# EAGLE design board (EAGLE 6.4)
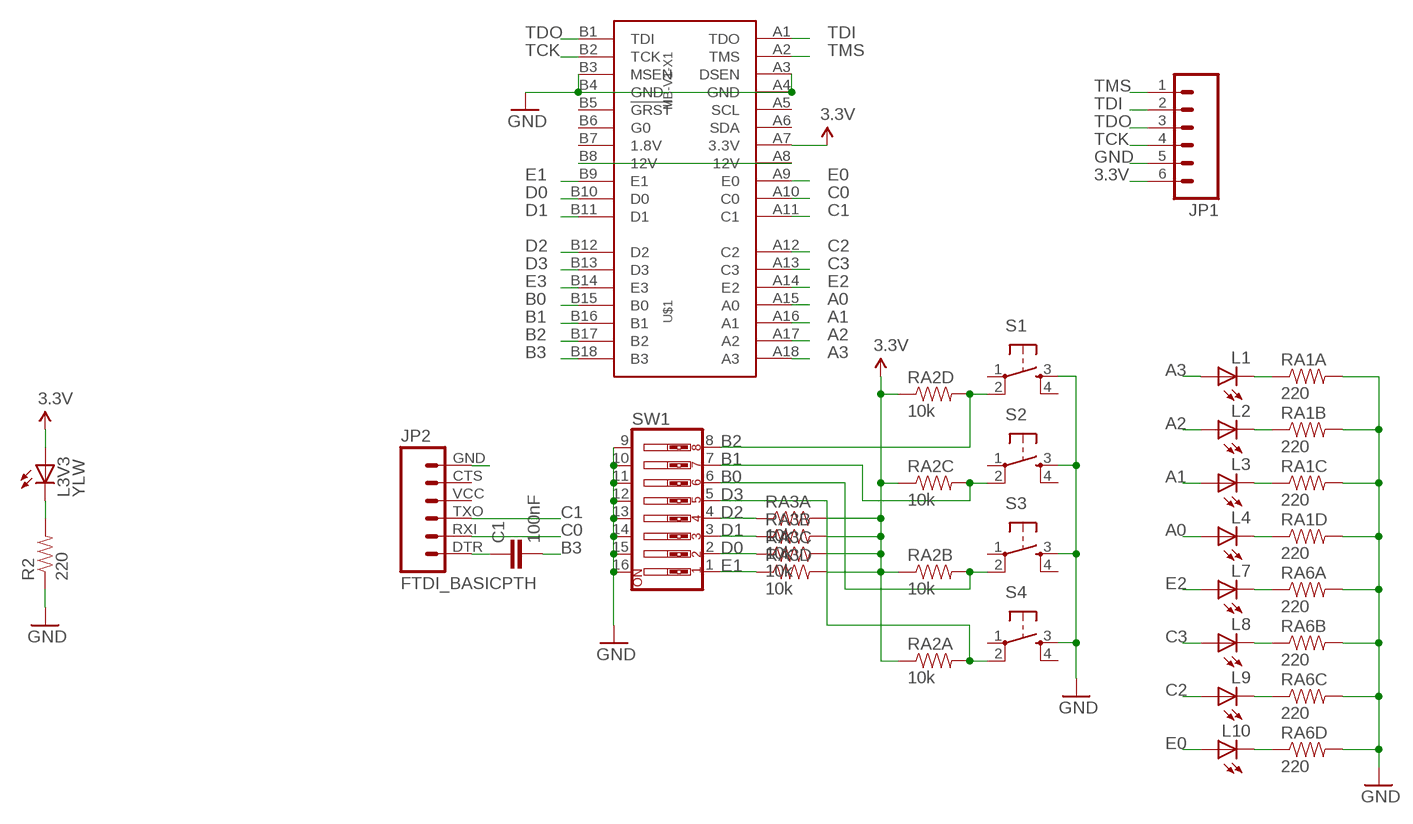
[diagram p0: schematic, sheet 1]

## Parts
C1  100nF  CAP0402-CAP  [0402-CAP]
JP1  M06LOCK  [1X06_LOCK]
JP2  FTDI_BASICPTH  [FTDI_BASIC]
L1  LED0603  [0603_LED]
L2  LED0603  [0603_LED]
L3  LED0603  [0603_LED]
L3V3  YLW  LED0603  [0603_LED]
L4  LED0603  [0603_LED]
L7  LED0603  [0603_LED]
L8  LED0603  [0603_LED]
L9  LED0603  [0603_LED]
L10  LED0603  [0603_LED]
R2  220  RESISTOR0603  [0603-RES]
RA1  220  RESISTOR_ARRAY0603_X4  [0603-ARV]
RA2  10k  RESISTOR_ARRAY0603_X4  [0603-ARV]
RA3  10k  RESISTOR_ARRAY0603_X4  [0603-ARV]
RA6  220  RESISTOR_ARRAY0603_X4  [0603-ARV]
S1  TAC_SWITCHPTH  [TACTILE-PTH]
S2  TAC_SWITCHPTH  [TACTILE-PTH]
S3  TAC_SWITCHPTH  [TACTILE-PTH]
S4  TAC_SWITCHPTH  [TACTILE-PTH]
SW1  SW_DIP-8  [DIPSWITCH-08]
U$1  MB-V1-X1  [PCIE-X1-EDGE]

## Nets
3.3V: JP1.6 L3V3.A RA2.1 RA2.2 RA2.3 RA2.4 RA3.5 RA3.6 RA3.7 RA3.8 U$1.A7(3.3V)
A0: L4.A U$1.A15(A0)
A1: L3.A U$1.A16(A1)
A2: L2.A U$1.A17(A2)
A3: L1.A U$1.A18(A3)
B0: RA2.7 S3.2 SW1.6 U$1.B15(B0)
B1: RA2.6 S2.2 SW1.7 U$1.B16(B1)
B2: RA2.5 S1.2 SW1.8 U$1.B17(B2)
B3: C1.2 U$1.B18(B3)
C0: JP2.RXI U$1.A10(C0)
C1: JP2.TXO U$1.A11(C1)
C2: L9.A U$1.A12(C2)
C3: L8.A U$1.A13(C3)
D0: RA3.3 SW1.2 U$1.B10(D0)
D1: RA3.2 SW1.3 U$1.B11(D1)
D2: RA3.1 SW1.4 U$1.B12(D2)
D3: RA2.8 S4.2 SW1.5 U$1.B13(D3)
E0: L10.A U$1.A9(E0)
E1: RA3.4 SW1.1 U$1.B9(E1)
E2: L7.A U$1.A14(E2)
E3: U$1.B14(E3)
GND: JP1.5 JP2.GND R2.1 RA1.5 RA1.6 RA1.7 RA1.8 RA6.5 RA6.6 RA6.7 RA6.8 S1.3 S2.3 S3.3 S4.3 SW1.9 SW1.10 SW1.11 SW1.12 SW1.13 SW1.14 SW1.15 SW1.16 U$1.A3(DSEN) U$1.A4(GND) U$1.B3(MSEN) U$1.B4(GND)
N$2: L1.C RA1.1
N$3: L2.C RA1.2
N$4: L3.C RA1.3
N$5: L4.C RA1.4
N$6: L3V3.C R2.2
N$11: C1.1 JP2.DTR
N$14: L7.C RA6.1
N$15: L8.C RA6.2
N$16: L9.C RA6.3
N$17: L10.C RA6.4
N$22: U$1.A8(12V) U$1.B8(12V)
TCK: JP1.4 U$1.B2(TCK)
TDI: JP1.2 U$1.A1(TDO)
TDO: JP1.3 U$1.B1(TDI)
TMS: JP1.1 U$1.A2(TMS)
Unconnected: JP2.CTS JP2.VCC S1.1 S1.4 S2.1 S2.4 S3.1 S3.4 S4.1 S4.4 U$1.A5(SCL) U$1.A6(SDA) U$1.B5(!GRST) U$1.B6(G0) U$1.B7(1.8V)

## Library data of the parts
C1 = kmod-passives:CAP: Capacitor Standard 0603 ceramic capacitor, and 0.1" leaded capacitor.
JP1 = SparkFun-Connectors:M06: Header 6 Standard 6-pin 0.1" header. Use with straight break away headers (SKU : PRT-00116), right angle break away headers (PRT-00553), swiss pins (PRT-00743), machine pins (PRT-00117), and female headers (PRT-00115). Molex polarized connector foot print use with SKU : PRT-08094 with associated crimp pins and housings. NOTES ON THE VARIANTS LOCK and LOCK_LONGPADS... This footprint was designed to help hold the alignment of a through-hole component (i.e. 6-pin header) while soldering it into place. You may notice that each hole has been shifted either up or down by 0.005 of an inch from it's more standard position (which is a perfectly straight line). This slight alteration caused the pins (the squares in the middle) to touch the edges of the holes. Because they are alternating, it causes a "brace" to hold the component in place. 0.005 has proven to be the perfect amount of "off-center" position when using our standard breakaway headers. Although looks a little odd when you look at the bare footprint, once you have a header in there, the alteration is very hard to notice. Also,if you push a header all the way into place, it is covered up entirely on the bottom side. This idea of altering the position of holes to aid alignment will be further integrated into the Sparkfun Library for other footprints. It can help hold any component with 3 or more connection pins.
JP2 = SparkFun-Connectors:FTDI_BASIC: FTDI Basic header with labels
L1-L3 L3V3 L4 L7-L10 = kmod-passives:LED
R2 = kmod-passives:RESISTOR: Resistor Basic schematic elements and footprints for 0603, 1206, and PTH resistors.
RA1-RA3 RA6 = kmod-passives:RESISTOR_ARRAY
S1-S4 = kmod-mechanical:TAC_SWITCH: Momentary Switch Button commonly used for reset or general input. Spark Fun Electronics SKU : COM-00097 SMT- SWCH-08247
SW1 = SparkFun-Electromechanical:SW_DIP-8: DIP Switch 8 Position Spark Fun Electronics SKU : COM-08034
U$1 = kmod-connectors:MB-V1-X1

## Board
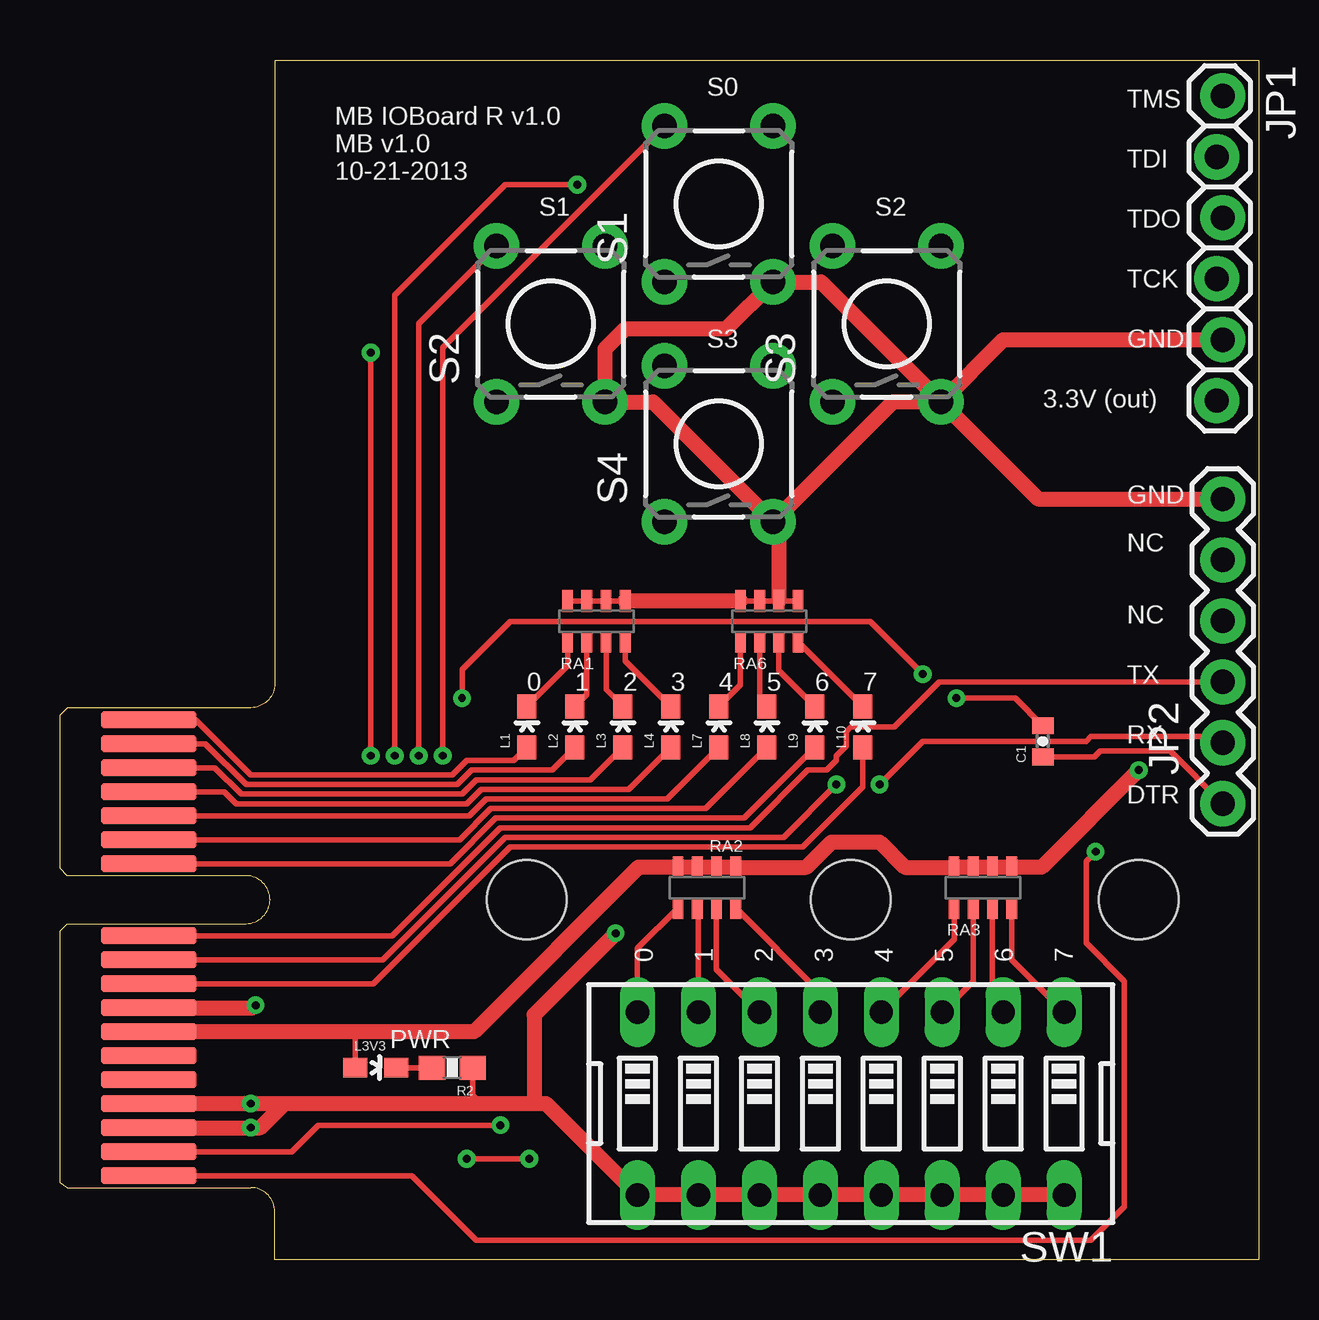
[diagram p1: board, top side]
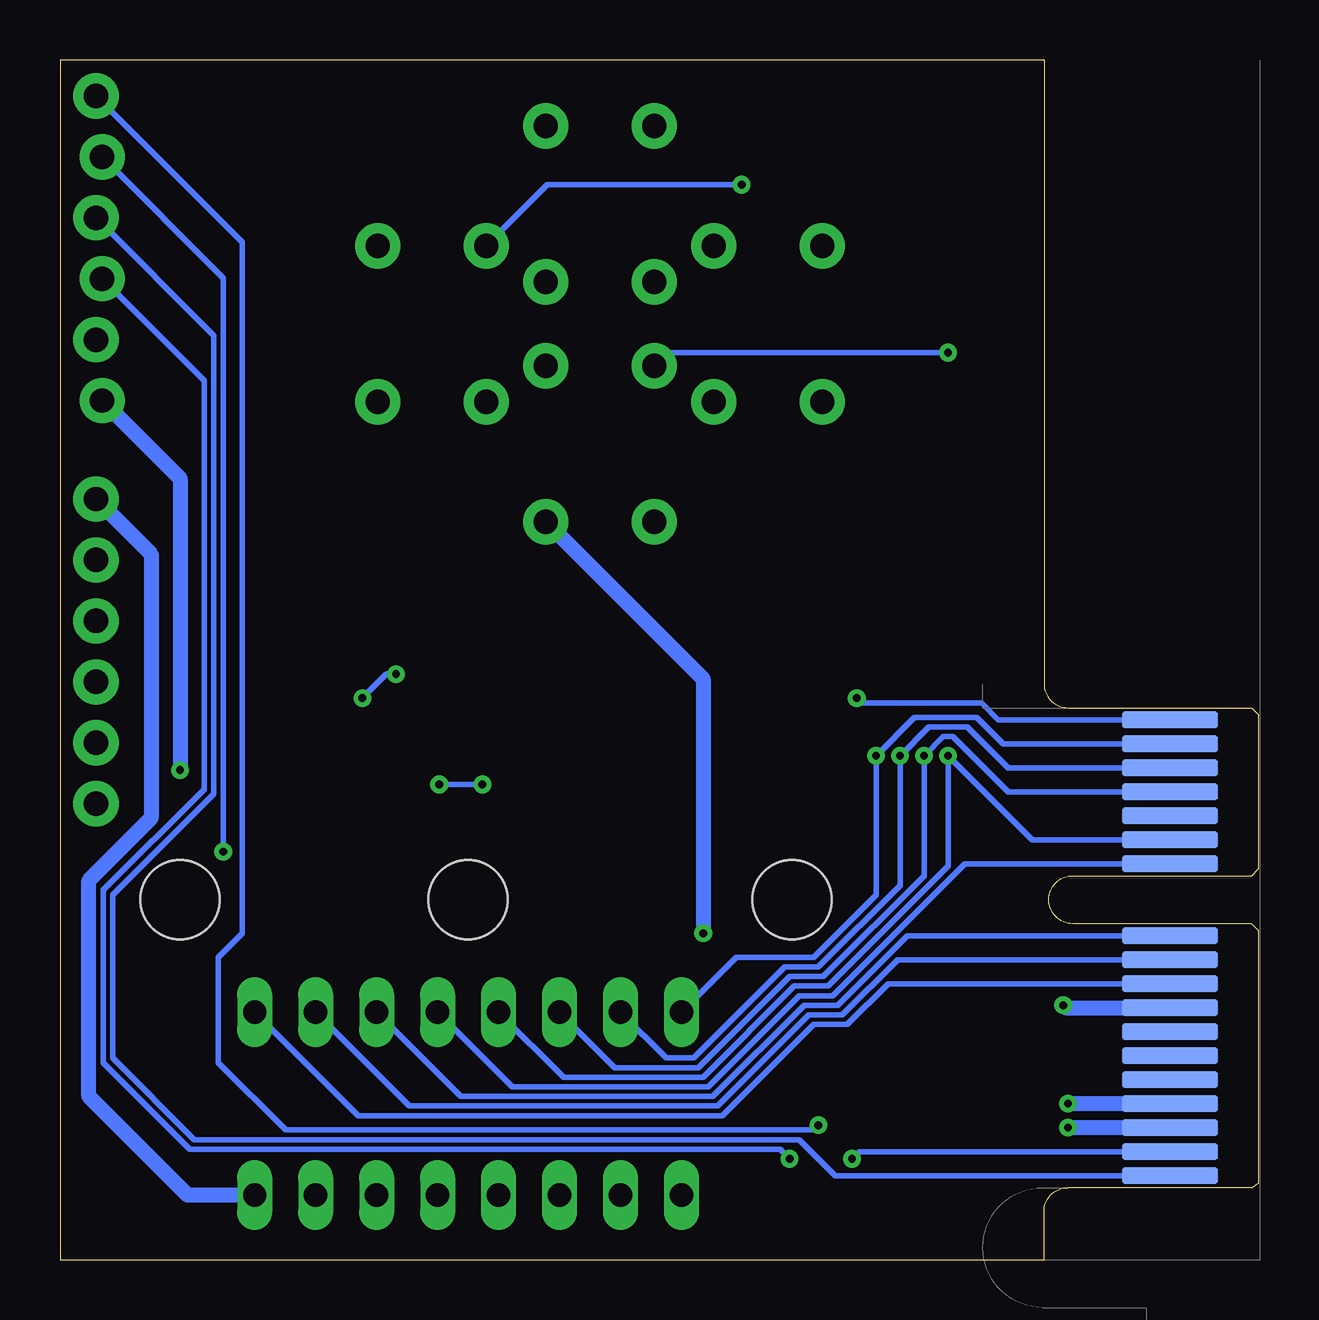
[diagram p2: board, bottom side, seen from below]

Size 49.95 x 50 mm. Coordinates in mm from the lower left corner, seen from the top.
Outline: 7.95,3 arc-90 8.95,2 8.95,0 49.95,0 49.95,50 8.95,50 8.95,24 arc-90 7.95,23
Copper layers (1*16): Top 0.035mm / dielectric 1.5mm / Bottom 0.035mm
Design rules "SeeedStudio_mine": minimum track width 6mil, minimum drill 12mil, track to track 6mil, track to pad 6mil, pad to pad 6mil, via to via 6mil, smd to smd 6mil, copper to edge 10mil, drill to drill 10mil, minimum pad ring 6mil, minimum via ring 8mil, stop-mask expansion 2mil, vias tented up to drill 25mil, thermal gap 10mil
Holes 3.3 mm at 44.95,15 32.95,15 19.45,15

### Footprints (pad centres in the part's own frame; a part is rotated, then mirrored left to right if it is on the bottom)
0402-CAP = smd 0.7 x 0.9: 1 -0.65,0; 2 0.65,0
1X06_LOCK = drill 1.016 pad 1.88: 1 0,0; 2 2.54,-0.254; 3 5.08,0; 4 7.62,-0.254; 5 10.16,0; 6 12.7,-0.254
FTDI_BASIC = drill 1.016 pad 1.88: CTS 10.16,0; DTR 0,0; GND 12.7,0; RXI 2.54,0; TXO 5.08,0; VCC 7.62,0
0603_LED = smd 0.8 x 1.003: A 0,-0.852; C 0,0.852
0603-RES = smd 1.1 x 1: 1 -0.85,0; 2 0.85,0
0603-ARV = smd 0.45 x 0.9: 1 -1.2,-0.85; 2 -0.4,-0.85; 3 0.4,-0.85; 4 1.2,-0.85; 5 1.2,0.85; 6 0.4,0.85; 7 -0.4,0.85; 8 -1.2,0.85
TACTILE-PTH = drill 1.016 pad 1.88: 1 -3.251,2.261; 2 3.251,2.261; 3 -3.251,-2.261; 4 3.251,-2.261
DIPSWITCH-08 = drill 0.97 long: 1 -8.89,-3.81; 2 -6.35,-3.81; 3 -3.81,-3.81; 4 -1.27,-3.81; 5 1.27,-3.81; 6 3.81,-3.81; 7 6.35,-3.81; 8 8.89,-3.81; 9 8.89,3.81; 10 6.35,3.81; 11 3.81,3.81; 12 1.27,3.81; 13 -1.27,3.81; 14 -3.81,3.81; 15 -6.35,3.81; 16 -8.89,3.81
PCIE-X1-EDGE = smd 0.7 x 4 bottom: A1 -11.5,-0.75; A2 -10.5,-0.75; A3 -9.5,-0.75; A4 -8.5,-0.75; A5 -7.5,-0.75; A6 -6.5,-0.75; A7 -5.5,-0.75; A8 -4.5,-0.75; A9 -3.5,-0.75; A10 -2.5,-0.75; A11 -1.5,-0.75; A12 1.5,-0.75; A13 2.5,-0.75; A14 3.5,-0.75; A15 4.5,-0.75; A16 5.5,-0.75; A17 6.5,-0.75; A18 7.5,-0.75 | smd 0.7 x 4: B1 -11.5,-0.75; B2 -10.5,-0.75; B3 -9.5,-0.75; B4 -8.5,-0.75; B5 -7.5,-0.75; B6 -6.5,-0.75; B7 -5.5,-0.75; B8 -4.5,-0.75; B9 -3.5,-0.75; B10 -2.5,-0.75; B11 -1.5,-0.75; B12 1.5,-0.75; B13 2.5,-0.75; B14 3.5,-0.75; B15 4.5,-0.75; B16 5.5,-0.75; B17 6.5,-0.75; B18 7.5,-0.75

### Placement (x,y rotation side)
C1  40.95,21.6 90 top
JP1  48.45,48.5 270 top
JP2  48.45,19 90 top
L1  19.45,22.2 0 top
L2  21.45,22.2 0 top
L3  23.45,22.2 0 top
L3V3  13.15,8 270 top
L4  25.45,22.2 0 top
L7  27.45,22.2 0 top
L8  29.45,22.2 0 top
L9  31.45,22.2 0 top
L10  33.45,22.2 0 top
R2  16.35,8 180 top
RA1  22.35,26.6 0 top
RA2  26.95,15.5 180 top
RA3  38.45,15.5 0 top
RA6  29.55,26.6 0 top
S1  27.45,44 90 top
S2  20.45,39 90 top
S3  34.45,39 90 top
S4  27.45,34 90 top
SW1  32.95,6.5 180 top
U$1  4.45,15 90 bottom

### Tracks (layer width: path | path; a pad name or v marks a point on that pad's centre or on a via)
3.3V  (via drill 0.33)
  Top 0.229: L3V3.A 12.3,9.25 12.55,9.5
  Top 0.635: U$1.A7 12.55,9.5 17.25,9.5 24.1,16.35 RA2.4 RA2.3 RA2.2 RA2.1 31.1,16.35 32.15,17.4 34.15,17.4 35.2,16.35 RA3.8 RA3.7 RA3.6 RA3.5 40.9,16.35 v44.95,20.4
  Bottom 0.635: JP1.6 44.95,32.55 v44.95,20.4
A0
  Top 0.229: L4.A 23.7,19.6 17.55,19.6 16.95,19 7.35,19 6.85,19.5 U$1.A15
A1
  Top 0.229: L3.A 22.1,20 17.35,20 16.75,19.4 7.55,19.4 6.45,20.5 U$1.A16
A2
  Top 0.229: L2.A 20.5,20.4 17.15,20.4 16.55,19.8 7.75,19.8 6.05,21.5 U$1.A17
A3
  Top 0.229: L1.A 18.9,20.8 16.95,20.8 16.35,20.2 7.95,20.2 5.65,22.5 U$1.A18
B0  (via drill 0.33)
  Top 0.229: SW1.6 27.35,12.1 RA2.7 | v13.95,21 13.95,40.2 18.55,44.8 v21.55,44.8
  Bottom 0.229: SW1.6 26.83,8 23.35,8 19.55,11.8 18.15,11.8 13.95,16 v13.95,21 13.15,21.8 12.75,21.8 10.45,19.5 U$1.B15 | v21.55,44.8 29.64,44.8 S3.2
B1  (via drill 0.33)
  Top 0.229: SW1.7 26.6,14.6 RA2.6 | v14.95,21 14.95,39.01 S2.2
  Bottom 0.229: SW1.7 24.69,8.4 23.55,8.4 19.75,12.2 18.35,12.2 14.95,15.6 v14.95,21 13.75,22.2 12.15,22.2 10.45,20.5 U$1.B16
B2  (via drill 0.33)
  Top 0.229: SW1.8 24.06,12.96 RA2.5 | v15.95,21 15.95,38.01 S1.2
  Bottom 0.229: SW1.8 21.77,12.6 18.55,12.6 15.95,15.2 v15.95,21 14.35,22.6 11.75,22.6 10.65,21.5 U$1.B17
B3  (via drill 0.33)
  Top 0.229: C1.2 39.8,23.4 v37.35,23.4 | v35.95,24.4 33.75,26.6 18.75,26.6 16.75,24.6 v16.75,23.4
  Bottom 0.229: v37.35,23.4 36.35,24.4 v35.95,24.4 | v16.75,23.4 16.55,23.2 11.55,23.2 10.85,22.5 U$1.B18
C0  (via drill 0.33)
  Top 0.229: v34.15,19.8 35.95,21.6 42.75,21.6 42.95,21.8 48.19,21.8 JP2.RXI | v32.35,19.8 30.15,17.6 18.55,17.6 13.45,12.5 U$1.A10
  Bottom 0.229: v34.15,19.8 v32.35,19.8
C1
  Top 0.229: JP2.TXO 36.63,24.08 34.75,22.2 32.95,22.2 32.75,22 32.75,21.4 32.35,21 32.35,20.8 31.95,20.4 31.15,20.4 28.75,18 18.35,18 13.85,13.5 U$1.A11
C2
  Top 0.229: L9.A 28.5,18.4 18.15,18.4 16.25,16.5 U$1.A12
C3
  Top 0.229: L8.A 26.9,18.8 17.95,18.8 16.65,17.5 U$1.A13
D0
  Top 0.229: SW1.2 38.85,10.76 RA3.3
  Bottom 0.229: SW1.2 35.39,6.4 22.55,6.4 18.75,10.2 17.35,10.2 15.05,12.5 U$1.B10
D1
  Top 0.229: SW1.3 38.05,11.6 RA3.2
  Bottom 0.229: SW1.3 33.25,6.8 22.75,6.8 18.95,10.6 17.55,10.6 14.65,13.5 U$1.B11
D2
  Top 0.229: SW1.4 37.25,13.34 RA3.1
  Bottom 0.229: SW1.4 31.11,7.2 22.95,7.2 19.15,11 17.75,11 12.25,16.5 U$1.B12
D3  (via drill 0.33)
  Top 0.229: SW1.5 31.68,11.12 RA2.8 | v12.95,21 v12.95,37.8
  Bottom 0.229: SW1.5 28.97,7.6 23.15,7.6 19.35,11.4 17.95,11.4 12.95,16.4 v12.95,21 9.45,17.5 U$1.B13 | v12.95,37.8 24.64,37.8 S4.2
E0
  Top 0.229: U$1.A9 13.05,11.5 18.75,17.2 30.95,17.2 33.45,19.7 L10.A
E1
  Top 0.229: SW1.1 39.65,12.5 RA3.4
  Bottom 0.229: SW1.1 37.53,6 22.35,6 18.55,9.8 17.15,9.8 15.45,11.5 U$1.B9
E2
  Top 0.229: L7.A 25.3,19.2 17.75,19.2 17.05,18.5 U$1.A14
GND  (via drill 0.33)
  Top 0.229: RA1.8 RA1.7 RA1.6 RA1.5 | RA6.8 RA6.7 RA6.6 RA6.5 | R2.1 17.2,6.85 17.55,6.5
  Top 0.635: SW1.16 SW1.15 SW1.14 SW1.13 SW1.12 SW1.11 SW1.10 SW1.9 20.25,6.5 17.55,6.5 9.35,6.5 | S3.3 31.71,40.75 S1.3 27.76,38.8 23.55,38.8 22.71,37.96 S2.3 24.71,35.75 S4.3 29.95,30.51 RA6.6 | S3.3 34.7,35.75 29.75,30.8 | S3.3 39.3,38.34 JP1.5 | S3.3 40.76,31.7 JP2.GND | RA6.8 RA1.5 | 9.35,6.5 v7.95,6.5 U$1.A4 | U$1.B3 v7.95,5.5 8.35,5.5 9.35,6.5 | v23.15,13.6 19.75,10.2 19.75,6.6
  Bottom 0.635: JP2.GND 46.15,29.4 46.15,18.4 48.75,15.8 48.75,6.8 44.64,2.69 SW1.16 | U$1.B3 v7.95,5.5 | U$1.A4 v7.95,6.5 | v23.15,13.6 23.15,24.2 29.7,30.75 S4.3
N$2
  Top 0.229: L1.C 21.15,24.75 RA1.1
N$3
  Top 0.229: L2.C 21.95,23.55 RA1.2
N$4
  Top 0.229: L3.C 22.75,23.75 RA1.3
N$5
  Top 0.229: L4.C 23.55,24.95 RA1.4
N$6
  Top 0.229: L3V3.C R2.2
N$11
  Top 0.229: JP2.DTR 46.25,21.2 43.35,21.2 43.1,20.95 C1.1
N$14
  Top 0.229: L7.C 28.35,23.95 RA6.1
N$15
  Top 0.229: L8.C 29.15,23.35 RA6.2
N$16
  Top 0.229: L9.C 29.95,24.55 RA6.3
N$17
  Top 0.229: L10.C RA6.4
N$22  (via drill 0.33)
  Top 0.635: U$1.A8 8.05,10.5 v8.15,10.6
  Bottom 0.635: v8.15,10.6 8.05,10.5 U$1.A8
TCK  (via drill 0.33)
  Top 0.229: v19.55,4.2 v16.95,4.2
  Bottom 0.229: JP1.4 43.95,36.63 43.95,19.6 48.15,15.4 48.15,8.2 44.55,4.6 19.95,4.6 v19.55,4.2 | 3.8,4.6 U$1.B2 16.65,4.5 v16.95,4.2
TDI  (via drill 0.33)
  Top 0.229: v43.15,17 42.75,16.6 42.75,13.2 44.35,11.6 44.35,2.2 42.95,0.8 17.35,0.8 14.65,3.5 U$1.A1
  Bottom 0.229: JP1.2 43.15,40.91 v43.15,17
TDO
  Bottom 0.229: JP1.3 43.55,38.52 43.55,19.4 47.75,15.2 47.75,8.4 44.35,5 19.15,5 17.65,3.5 U$1.B1
TMS  (via drill 0.33)
  Top 0.229: v18.35,5.6 10.75,5.6 9.65,4.5 U$1.A2
  Bottom 0.229: JP1.1 42.35,42.4 42.35,13.6 43.35,12.6 43.35,8.2 40.55,5.4 18.55,5.4 v18.35,5.6

### Text on the board
tPlace: S0 | TMS | TDI | MB IOBoard R v1.0 / MB v1.0 / 10-21-2013 | S1 | S2 | TDO | TCK | S3 | GND | 3.3V (out) | GND | NC | NC | 0 | 1 | 2 | 3 | 4 | 5 | 6 | 7 | TX | RX | DTR | 0 | 1 | 2 | 3 | 4 | 5 | 6 | 7 | PWR